# EAGLE design interface (EAGLE 5.07)
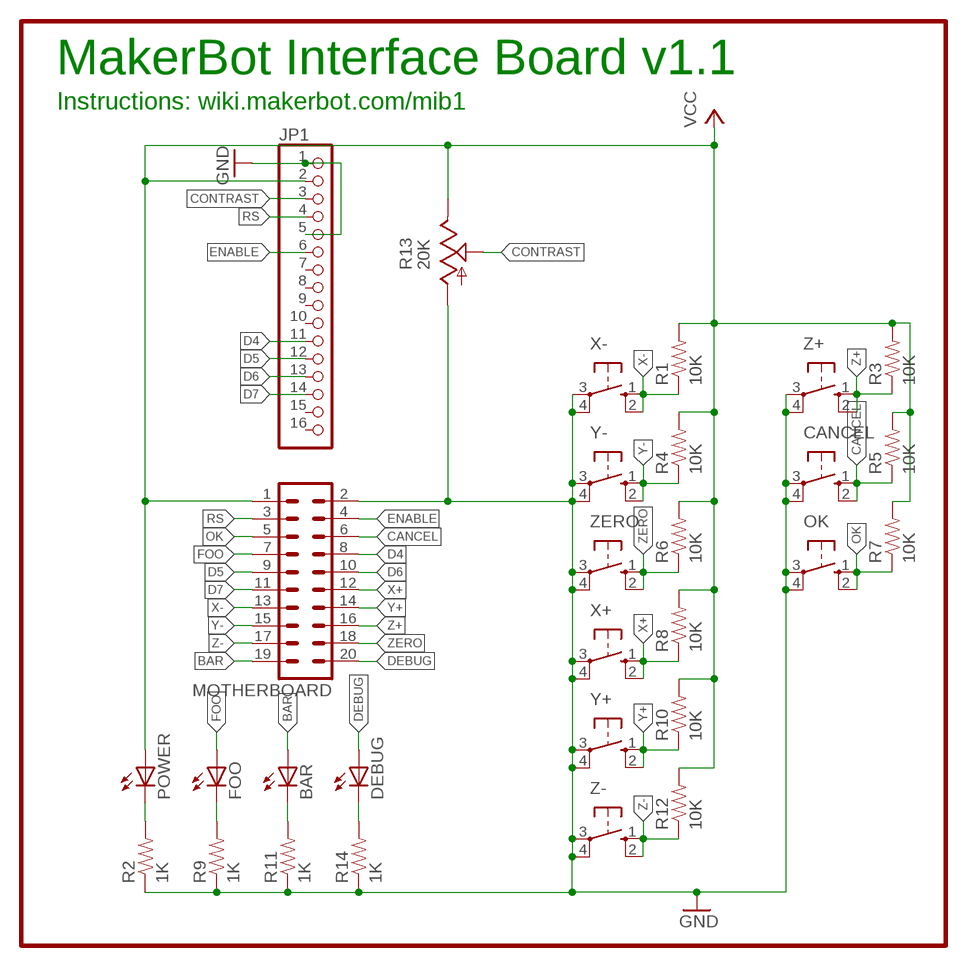
[diagram p0: schematic, sheet 1]

## Parts
BAR  LED5MM  [LED5MM]
CANCEL  40-XX  [B3F-40XX]
DEBUG  LED5MM  [LED5MM]
FOO  LED5MM  [LED5MM]
JP1  PINHD-1X16  [1X16]
MOTHERBOARD  ML20  [ML20]
OK  40-XX  [B3F-40XX]
POWER  LED5MM  [LED5MM]
R1  10K  RESISTOR1206  [1206]
R2  1K  RESISTOR1206  [1206]
R3  10K  RESISTOR1206  [1206]
R4  10K  RESISTOR1206  [1206]
R5  10K  RESISTOR1206  [1206]
R6  10K  RESISTOR1206  [1206]
R7  10K  RESISTOR1206  [1206]
R8  10K  RESISTOR1206  [1206]
R9  1K  RESISTOR1206  [1206]
R10  10K  RESISTOR1206  [1206]
R11  1K  RESISTOR1206  [1206]
R12  10K  RESISTOR1206  [1206]
R13  20K  TRIM_US-B25P  [B25P]
R14  1K  RESISTOR1206  [1206]
X+  40-XX  [B3F-40XX]
X-  40-XX  [B3F-40XX]
Y+  40-XX  [B3F-40XX]
Y-  40-XX  [B3F-40XX]
Z+  40-XX  [B3F-40XX]
Z-  40-XX  [B3F-40XX]
ZERO  40-XX  [B3F-40XX]

## Nets
BAR: BAR.A MOTHERBOARD.19
CANCEL: CANCEL.1(S) CANCEL.2(S1) MOTHERBOARD.6 R5.1
CONTRAST: JP1.3 R13.S
D4: JP1.11 MOTHERBOARD.8
D5: JP1.12 MOTHERBOARD.9
D6: JP1.13 MOTHERBOARD.10
D7: JP1.14 MOTHERBOARD.11
DEBUG: DEBUG.A MOTHERBOARD.20
ENABLE: JP1.6 MOTHERBOARD.4
FOO: FOO.A MOTHERBOARD.7
GND: CANCEL.3(P) CANCEL.4(P1) JP1.1 JP1.5 MOTHERBOARD.2 OK.3(P) OK.4(P1) R2.1 R9.1 R11.1 R13.A R14.1 X+.3(P) X+.4(P1) X-.3(P) X-.4(P1) Y+.3(P) Y+.4(P1) Y-.3(P) Y-.4(P1) Z+.3(P) Z+.4(P1) Z-.3(P) Z-.4(P1) ZERO.3(P) ZERO.4(P1)
N$1: POWER.K(C) R2.2
N$2: FOO.K(C) R9.2
N$3: BAR.K(C) R11.2
N$4: DEBUG.K(C) R14.2
OK: MOTHERBOARD.5 OK.1(S) OK.2(S1) R7.1
RS: JP1.4 MOTHERBOARD.3
VCC: JP1.2 MOTHERBOARD.1 POWER.A R1.2 R3.2 R4.2 R5.2 R6.2 R7.2 R8.2 R10.2 R12.2 R13.E
X+: MOTHERBOARD.12 R8.1 X+.1(S) X+.2(S1)
X-: MOTHERBOARD.13 R1.1 X-.1(S) X-.2(S1)
Y+: MOTHERBOARD.14 R10.1 Y+.1(S) Y+.2(S1)
Y-: MOTHERBOARD.15 R4.1 Y-.1(S) Y-.2(S1)
Z+: MOTHERBOARD.16 R3.1 Z+.1(S) Z+.2(S1)
Z-: MOTHERBOARD.17 R12.1 Z-.1(S) Z-.2(S1)
ZERO: MOTHERBOARD.18 R6.1 ZERO.1(S) ZERO.2(S1)
Unconnected: JP1.7 JP1.8 JP1.9 JP1.10 JP1.15 JP1.16

## Notes on the sheet
- MakerBot Interface Board v1.1
- Instructions: wiki.makerbot.com/mib1

## Library data of the parts
BAR DEBUG FOO POWER = led:LED: LED OSRAM: - CHIPLED LG R971, LG N971, LY N971, LG Q971, LY Q971, LO R971, LY R971 LH N974, LH R974 LS Q976, LO Q976, LY Q976 LO Q996 - Hyper CHIPLED LW Q18S LB Q993, LB Q99A, LB R99A - SideLED LS A670, LO A670, LY A670, LG A670, LP A670 LB A673, LV A673, LT A673, LW A673 LH A674 LY A675 LS A676, LA A676, LO A676, LY A676, LW A676 LS A679, LY A679, LG A679 - Hyper Micro SIDELED® LS Y876, LA Y876, LO Y876, LY Y876 LT Y87S - SmartLED LW L88C, LW L88S LB L89C, LB L89S, LG L890 LS L89K, LO L89K, LY L89K LS L896, LA L896, LO L896, LY L896 - TOPLED LS T670, LO T670, LY T670, LG T670, LP T670 LSG T670, LSP T670, LSY T670, LOP T670, LYG T670 LG T671, LOG T671, LSG T671 LB T673, LV T673, LT T673, LW T673 LH T674 LS T676, LA T676, LO T676, LY T676, LB T676, LH T676, LSB T676, LW T676 LB T67C, LV T67C, LT T67C, LS T67K, LO T67K, LY T67K, LW E67C LS E67B, LA E67B, LO E67B, LY E67B, LB E67C, LV E67C, LT E67C LW T67C LS T679, LY T679, LG T679 LS T770, LO T770, LY T770, LG T770, LP T770 LB T773, LV T773, LT T773, LW T773 LH T774 LS E675, LA E675, LY E675, LS T675 LS T776, LA T776, LO T776, LY T776, LB T776 LHGB T686 LT T68C, LB T68C - Hyper Mini TOPLED® LB M676 - Mini TOPLED Santana® LG M470 LS M47K, LO M47K, LY M47K Source: http://www.osram.convergy.de LUXEON: - LUMILED® LXK2-PW12-R00, LXK2-PW12-S00, LXK2-PW14-U00, LXK2-PW14-V00 LXK2-PM12-R00, LXK2-PM12-S00, LXK2-PM14-U00 LXK2-PE12-Q00, LXK2-PE12-R00, LXK2-PE12-S00, LXK2-PE14-T00, LXK2-PE14-U00 LXK2-PB12-K00, LXK2-PB12-L00, LXK2-PB12-M00, LXK2-PB14-N00, LXK2-PB14-P00, LXK2-PB14-Q00 LXK2-PR12-L00, LXK2-PR12-M00, LXK2-PR14-Q00, LXK2-PR14-R00 LXK2-PD12-Q00, LXK2-PD12-R00, LXK2-PD12-S00 LXK2-PH12-R00, LXK2-PH12-S00 LXK2-PL12-P00, LXK2-PL12-Q00, LXK2-PL12-R00 Source: www.luxeon.com KINGBRIGHT: KA-3528ASYC Source: www.kingbright.com
CANCEL OK X+ X- Y+ Y- Z+ Z- ZERO = switch-omron:40-XX: OMRON SWITCH
JP1 = pinhead:PINHD-1X16: PIN HEADER
MOTHERBOARD = con-ml:ML20: HARTING
R1-R12 R14 = SparkFun:RESISTOR: Resistor Basic schematic elements and footprints for 0603, 1206, and PTH 1/10th watt (small) resistors.
R13 = pot:TRIM_US-: POTENTIOMETER

## Net classes
0 default: width 0.508 mm, clearance 0.381 mm

## Board
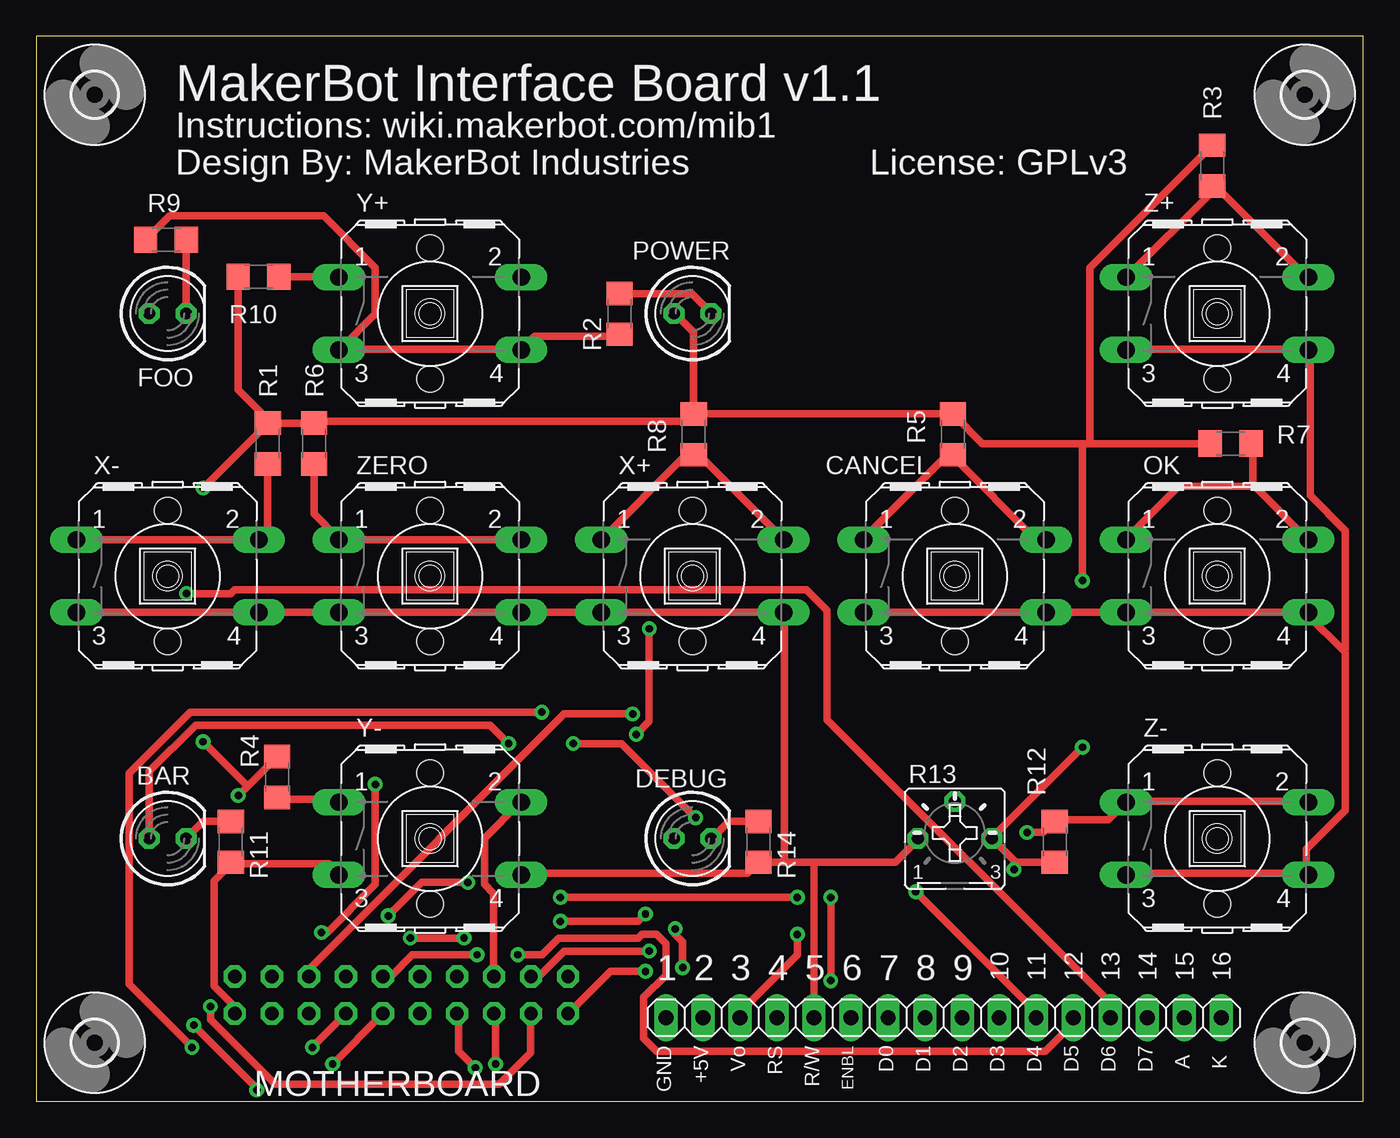
[diagram p1: board, top side]
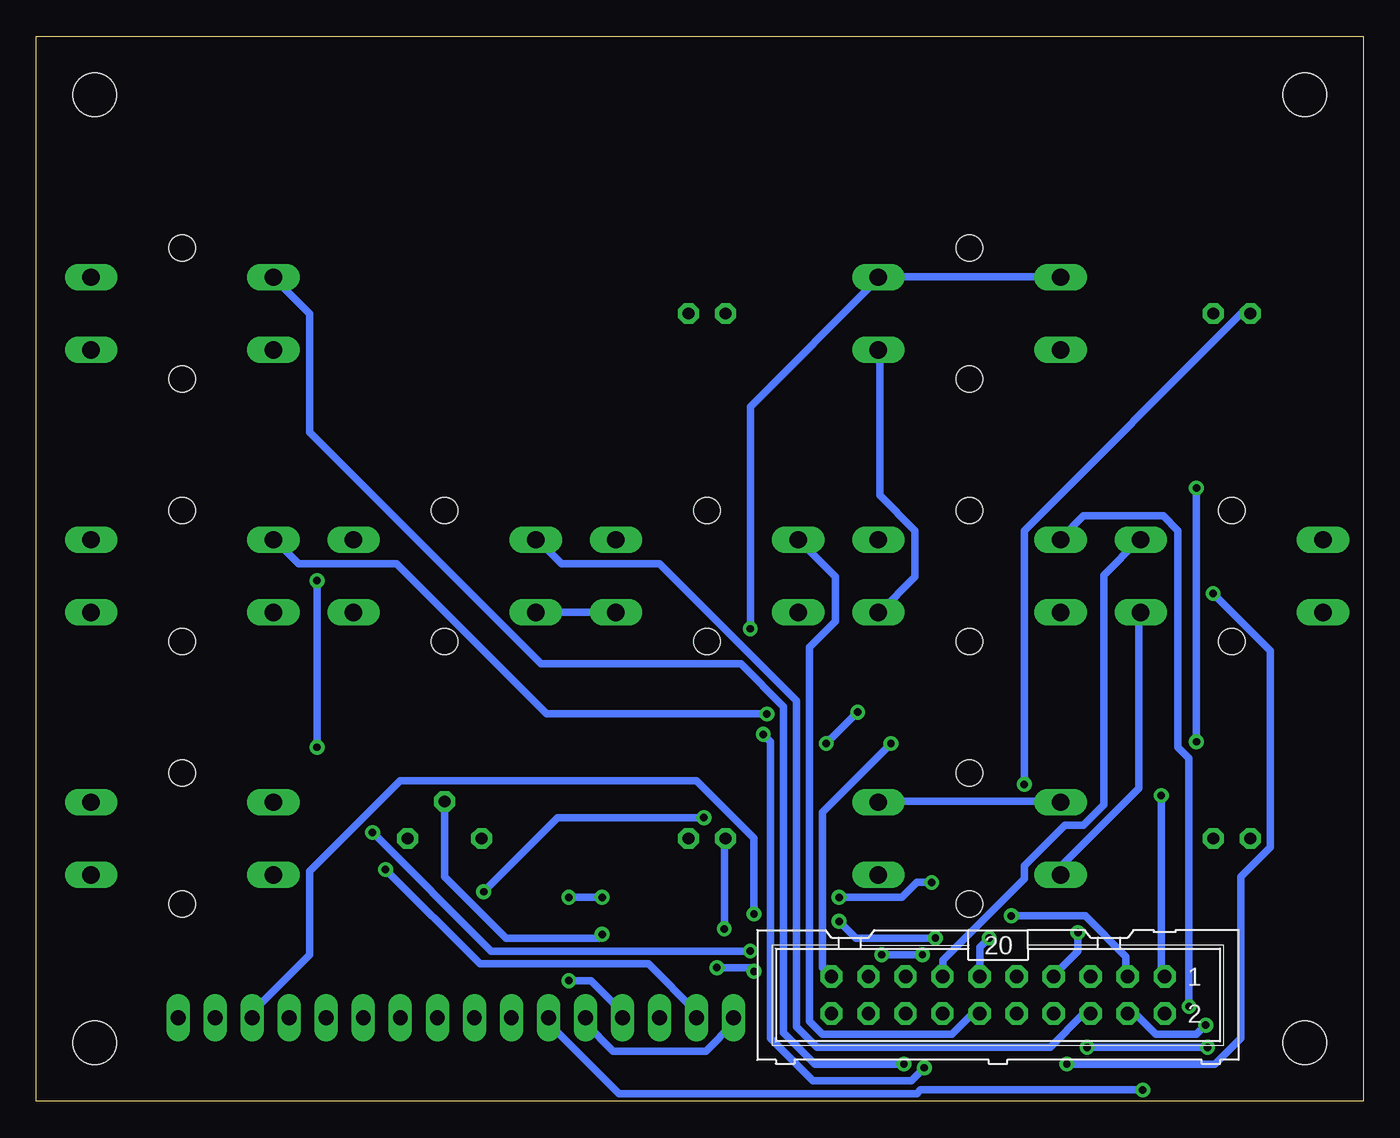
[diagram p2: board, bottom side, seen from below]

Size 91 x 73.02 mm. Coordinates in mm from the lower left corner, seen from the top.
Outline: 0,0 91,0 91,73.02 0,73.02 0,0
Copper layers (1*16): Top 0.035mm / dielectric 1.5mm / Bottom 0.035mm
Design rules "SparkFun": minimum track width 8mil, minimum drill 20mil, track to track 8mil, track to pad 8mil, pad to pad 8mil, via to via 8mil, smd to smd 8mil, copper to edge 10mil, drill to drill 8mil, minimum pad ring 12mil, minimum via ring 10mil, stop-mask expansion 4mil, vias tented up to drill 25mil, thermal gap 10mil

### Footprints (pad centres in the part's own frame; a part is rotated, then mirrored left to right if it is on the bottom)
LED5MM = drill 0.813 octagon: A -1.27,0; K 1.27,0
B3F-40XX = drill 1.194 long: 1 -6.248,2.489; 2 6.248,2.489; 3 -6.248,-2.489; 4 6.248,-2.489 | hole 1.803: 0,-4.496; 0,4.496
1X16 = drill 1.016 long: 1 -19.05,0; 2 -16.51,0; 3 -13.97,0; 4 -11.43,0; 5 -8.89,0; 6 -6.35,0; 7 -3.81,0; 8 -1.27,0; 9 1.27,0; 10 3.81,0; 11 6.35,0; 12 8.89,0; 13 11.43,0; 14 13.97,0; 15 16.51,0; 16 19.05,0
ML20 = drill 0.914 octagon: 1 -11.43,-1.27; 2 -11.43,1.27; 3 -8.89,-1.27; 4 -8.89,1.27; 5 -6.35,-1.27; 6 -6.35,1.27; 7 -3.81,-1.27; 8 -3.81,1.27; 9 -1.27,-1.27; 10 -1.27,1.27; 11 1.27,-1.27; 12 1.27,1.27; 13 3.81,-1.27; 14 3.81,1.27; 15 6.35,-1.27; 16 6.35,1.27; 17 8.89,-1.27; 18 8.89,1.27; 19 11.43,-1.27; 20 11.43,1.27
1206 = smd 1.6 x 1.8: 1 -1.4,0; 2 1.4,0
B25P = drill 0.813 octagon: A -2.54,0; E 2.54,0; S 0,2.54
3,0 = hole 3: 0,0

### Placement (x,y rotation side)
BAR  9,18.02 0 top
CANCEL  63,36.02 0 top
DEBUG  45,18.02 0 top
FOO  9,54.02 0 top
JP1  62.23,5.73 0 top
MOTHERBOARD  25.04,7.28 180 bottom
OK  81,36.02 0 top
POWER  45,54.02 0 top
R1  15.88,45.1 90 top
R2  40.01,53.99 90 top
R3  80.64,64.15 90 top
R4  16.51,22.24 90 top
R5  62.87,45.73 90 top
R6  19.05,45.1 90 top
R7  81.92,45.1 180 top
R8  45.09,45.73 90 top
R9  8.89,59.07 0 top
R10  15.24,56.53 180 top
R11  13.34,17.8 90 top
R12  69.85,17.8 270 top
R13  63,18.02 0 top
R14  49.53,17.8 90 top
U$1  [3,0]  4,69.02 0 top
U$2  [3,0]  4,4.01 0 top
U$3  [3,0]  87,69.02 0 top
U$4  [3,0]  87,4.01 0 top
X+  45,36.02 0 top
X-  9,36.02 0 top
Y+  27,54.02 0 top
Y-  27,18.02 0 top
Z+  81,54.02 0 top
Z-  81,18.02 0 top
ZERO  27,36.02 0 top

### Tracks (layer width: path | path; a pad name or v marks a point on that pad's centre or on a via)
BAR  (via drill 0.51)
  Top 0.508: v32.38,24.53 31.11,25.8 10.92,25.8 7.75,22.62 7.75,18.05 BAR.A
  Bottom 0.508: v32.38,24.53 37.08,19.83 37.08,9.16 36.58,8.65 MOTHERBOARD.19
CANCEL
  Top 0.508: CANCEL.1 56.77,38.62 62.36,44.21 62.87,44.21 R5.1 62.99,44.08 68.45,38.62 69.22,38.62 CANCEL.2
  Bottom 0.508: MOTHERBOARD.6 18.8,5.98 19.18,5.98 21.46,3.7 37.47,3.7 38.86,5.09 38.86,27.45 48.26,36.84 54.99,36.84 56.64,38.5 CANCEL.1
CONTRAST  (via drill 0.51)
  Top 0.508: v52.2,11.45 52.2,10.05 48.26,6.11 JP1.3
  Bottom 0.508: v52.2,11.45 52.45,11.19 58.8,11.19 62.99,15.38 62.99,20.46 R13.S
D4  (via drill 0.51)
  Top 0.508: v18.92,3.7 21.21,5.98 MOTHERBOARD.8 | v10.67,3.7 6.35,8.02 6.35,22.49 10.54,26.69 v34.67,26.69 | v36.83,24.53 40.13,24.53 v45.21,19.45 | v60.33,14.37 68.58,6.11 JP1.11
  Bottom 0.508: v10.67,3.7 v18.92,3.7 | v34.67,26.69 v36.83,24.53 | v45.21,19.45 55.24,19.45 v60.33,14.37
D5  (via drill 0.51)
  Top 0.508: v30.23,10.05 25.78,10.05 24.38,8.65 23.88,8.65 MOTHERBOARD.9 | v33.02,10.05 34.67,10.05 35.81,11.19 41.27,11.19 41.53,11.45 42.55,11.45 43.18,10.81 43.18,8.65 41.66,7.13 41.66,4.33 42.55,3.44 69.22,3.44 71.12,5.35 JP1.12
  Bottom 0.508: v30.23,10.05 v33.02,10.05
D6  (via drill 0.51)
  Top 0.508: v20.32,2.56 23.75,5.98 MOTHERBOARD.10 | v10.29,34.81 13.34,34.81 13.59,35.07 52.83,35.07 54.23,33.67 54.23,26.18 73.66,6.75 JP1.13
  Bottom 0.508: v20.32,2.56 10.16,2.56 8.38,4.33 8.38,15.38 6.35,17.41 6.35,30.88 v10.29,34.81
D7  (via drill 0.51)
  Top 0.508: v25.65,11.19 v29.34,11.19 | v35.94,12.33 41.27,12.33 v41.78,12.84
  Bottom 0.508: v25.65,11.19 26.29,10.56 26.29,8.65 MOTHERBOARD.11 | v29.34,11.19 34.8,11.19 v35.94,12.33 | v41.78,12.84 41.78,18.05 45.72,21.99 66.04,21.99 72.26,15.76 72.26,10.05 76.2,6.11 JP1.14
DEBUG  (via drill 0.51)
  Top 0.508: v43.81,11.83 43.81,11.45 44.32,10.94 v44.32,9.16 | v41.78,8.91 39.37,8.91 36.58,6.11 MOTHERBOARD.20
  Bottom 0.508: v43.81,11.83 43.81,17.92 DEBUG.A | v44.32,9.16 42.04,9.16 v41.78,8.91
ENABLE  (via drill 0.51)
  Top 0.508: v10.79,5.22 15.11,0.9 v15.11,0.78
  Bottom 0.508: v10.79,5.22 11.43,4.59 14.22,4.59 15.62,5.98 16.13,5.98 MOTHERBOARD.4 | v15.11,0.78 30.35,0.78 30.61,0.52 51.05,0.52 55.88,5.35 JP1.6
FOO  (via drill 0.51)
  Top 0.508: v23.24,21.73 23.24,14.87 19.94,11.57 v19.56,11.57
  Bottom 0.508: v23.24,21.73 23.24,39.13 8.38,53.99 7.75,53.99 FOO.A | v19.56,11.57 19.56,10.3 21.21,8.65 MOTHERBOARD.7
GND
  Top 0.508: Z+.3 74.8,51.58 87.12,51.58 Z+.4 87.38,51.32 87.38,41.54 89.79,39.13 89.79,31 89.66,30.88 | Z-.3 74.8,15.64 87.12,15.64 Z-.4 87.12,15.89 87.12,17.29 89.79,19.95 89.79,30.75 89.66,30.88 | 89.66,30.88 87.25,33.29 OK.4 87.12,33.54 74.93,33.54 OK.3 74.68,33.54 69.34,33.54 CANCEL.4 69.09,33.54 56.77,33.54 CANCEL.3 | 53.34,16.4 58.93,16.4 60.45,17.92 R13.A | 51.31,16.4 53.34,16.4 | 51.31,16.4 R14.1 49.4,16.27 48.77,15.64 33.27,15.64 Y-.4 | 53.34,16.4 JP1.5 | R2.1 40.01,52.47 34.16,52.47 33.27,51.58 Y+.4 33.02,51.58 21.08,51.58 Y+.3 20.83,51.58 23.24,53.99 23.24,57.16 19.68,60.72 9.14,60.72 R9.1 | Y-.3 20.7,15.64 20.07,16.27 13.34,16.27 R11.1 13.21,16.14 12.19,15.13 12.19,7.89 13.59,6.49 13.59,6.11 MOTHERBOARD.2 | X-.3 2.79,33.54 15.24,33.54 X-.4 15.49,33.54 20.7,33.54 ZERO.3 20.95,33.54 33.02,33.54 ZERO.4 33.27,33.54 38.73,33.54 X+.3 38.99,33.54 51.18,33.54 X+.4 51.31,33.29 51.31,16.4
  Bottom 0.508: JP1.1 43.18,5.35 45.09,3.44 51.44,3.44 53.34,5.35 JP1.5 | X+.4 51.31,33.54 56.64,33.54 CANCEL.3 | Y-.3 20.7,15.64 20.7,16.14 15.37,21.48 15.37,33.42 X-.4 | Y+.4 33.15,51.45 33.15,41.54 30.73,39.13 30.73,35.96 33.15,33.54 ZERO.4
N$1
  Top 0.508: R2.2 44.96,55.39 46.23,54.12 POWER.K
N$2
  Top 0.508: R9.2 10.29,54.12 FOO.K
N$3
  Top 0.508: R11.2 11.43,19.19 10.29,18.05 BAR.K
N$4
  Top 0.508: R14.2 47.5,19.19 46.35,18.05 DEBUG.K
OK  (via drill 0.51)
  Top 0.508: 83.44,42.31 83.44,45.1 R7.1 | 83.44,42.31 87.12,38.62 OK.2 | v40.89,26.56 36.2,26.56 18.8,9.16 18.8,8.65 MOTHERBOARD.5 | 83.44,42.31 83.31,42.18 78.36,42.18 74.8,38.62 OK.1
  Bottom 0.508: v40.89,26.56 56.01,26.56 66.29,36.84 73.03,36.84 74.68,38.5 OK.1
RS  (via drill 0.51)
  Top 0.508: v24.13,12.71 26.42,15 v29.59,15 | v35.94,13.99 v52.2,13.99 | v54.48,13.99 v54.48,8.27
  Bottom 0.508: v24.13,12.71 19.05,12.71 16.26,9.92 16.26,8.65 MOTHERBOARD.3 | v29.59,15 30.61,15 31.62,13.99 v35.94,13.99 | v52.2,13.99 v54.48,13.99 | v54.48,8.27 52.96,8.27 50.8,6.11 JP1.4
VCC  (via drill 0.51)
  Top 0.508: 67.18,16.4 R12.2 | 67.18,16.4 65.66,17.92 R13.E 65.66,18.18 v71.75,24.27 | v67.06,15.89 67.06,16.27 67.18,16.4 | v13.84,20.97 14.48,21.61 | 14.48,21.61 R4.2 | R1.2 R6.2 19.18,46.62 44.32,46.62 44.83,47.13 R8.2 | R10.2 13.84,48.78 15.88,46.75 R1.2 | R8.2 45.09,52.72 43.81,53.99 POWER.A | R8.2 45.21,47.13 R5.2 62.99,47.01 64.9,45.1 71.75,45.1 | 71.75,45.1 72.26,45.1 | 72.26,45.1 R7.2 | R3.2 72.26,57.16 72.26,45.1 | v11.43,42.05 15.75,46.37 R1.2 | 14.48,21.61 v11.43,24.65 | 71.75,45.1 v71.75,35.7
  Bottom 0.508: JP1.2 45.72,6.11 49.02,9.41 60.58,9.41 v67.06,15.89 | v13.84,20.97 13.84,8.78 13.72,8.65 MOTHERBOARD.1 | v11.43,24.65 v11.43,42.05 | v71.75,35.7 v71.75,24.27
X+
  Top 0.508: X+.2 51.18,38.62 45.59,44.21 45.09,44.21 R8.1 44.96,44.08 44.32,44.08 38.86,38.62 X+.1
  Bottom 0.508: MOTHERBOARD.12 26.42,5.98 26.8,5.98 28.19,4.59 37.08,4.59 37.97,5.48 37.97,31.13 36.2,32.91 36.2,35.96 38.73,38.5 X+.1
X-
  Top 0.508: R1.1 15.88,39.13 15.37,38.62 X-.2 15.11,38.5 2.79,38.5 X-.1
  Bottom 0.508: MOTHERBOARD.13 28.83,8.65 28.83,9.67 23.24,15.26 23.24,16.14 20.45,18.94 19.18,18.94 17.78,20.34 17.78,36.08 15.37,38.5 X-.2
Y+  (via drill 0.51)
  Top 0.508: R10.1 20.7,56.53 Y+.1 | v30.1,2.3 28.96,3.44 28.96,5.98 MOTHERBOARD.14 | v41.15,25.16 42.04,26.05 v42.04,32.4
  Bottom 0.508: v30.1,2.3 30.99,1.41 37.72,1.41 40.64,4.33 40.64,24.65 v41.15,25.16 | v42.04,32.4 42.04,47.64 33.27,56.4 Y+.2 33.02,56.53 20.83,56.53 Y+.1
Y-
  Top 0.508: R4.1 16.51,20.72 20.57,20.72 20.7,20.59 Y-.1 | MOTHERBOARD.15 31.37,8.65 31.37,14.24 30.73,14.87 30.73,18.05 33.15,20.46 Y-.2
  Bottom 0.508: Y-.1 20.83,20.59 33.15,20.59 Y-.2
Z+  (via drill 0.51)
  Top 0.508: Z+.1 74.8,56.53 80.64,62.37 R3.1 80.77,62.88 87.12,56.53 Z+.2 | v31.5,2.56 31.5,5.98 MOTHERBOARD.16
  Bottom 0.508: v31.5,2.56 37.59,2.56 39.75,4.71 39.75,27.07 42.67,29.99 56.39,29.99 72.26,45.86 72.26,53.99 74.68,56.4 Z+.1
Z-  (via drill 0.51)
  Top 0.508: v42.04,10.3 36.2,10.3 34.54,8.65 34.04,8.65 MOTHERBOARD.17 | v67.94,18.43 69.09,18.43 69.72,19.07 R12.1 69.85,19.32 73.53,19.32 74.68,20.46 Z-.1 74.93,20.59 87.12,20.59 Z-.2
  Bottom 0.508: v42.04,10.3 59.82,10.3 v67.94,18.43
ZERO  (via drill 0.51)
  Top 0.508: R6.1 19.05,40.27 20.7,38.62 ZERO.1 20.95,38.5 33.15,38.5 ZERO.2 | v11.94,6.49 11.94,5.6 16.38,1.16 31.75,1.16 33.91,3.32 33.91,5.98 MOTHERBOARD.18
  Bottom 0.508: v11.94,6.49 11.94,23.51 12.7,24.27 12.7,39.13 13.72,40.15 19.18,40.15 20.7,38.62 ZERO.1

### Text on the board
tPlace: MakerBot Interface Board v1.1 | Instructions: wiki.makerbot.com/mib1 | Design By: MakerBot Industries | License: GPLv3 | 1 | 2 | 3 | 4 | 5 | 6 | 7 | 8 | 9 | 10 | 11 | 12 | 13 | 14 | 15 | 16 | GND | +5V | Vo | RS | R/W | ENBL | D0 | D1 | D2 | D3 | D4 | D5 | D6 | D7 | A | K